# Altium project Relay.PrjPcb
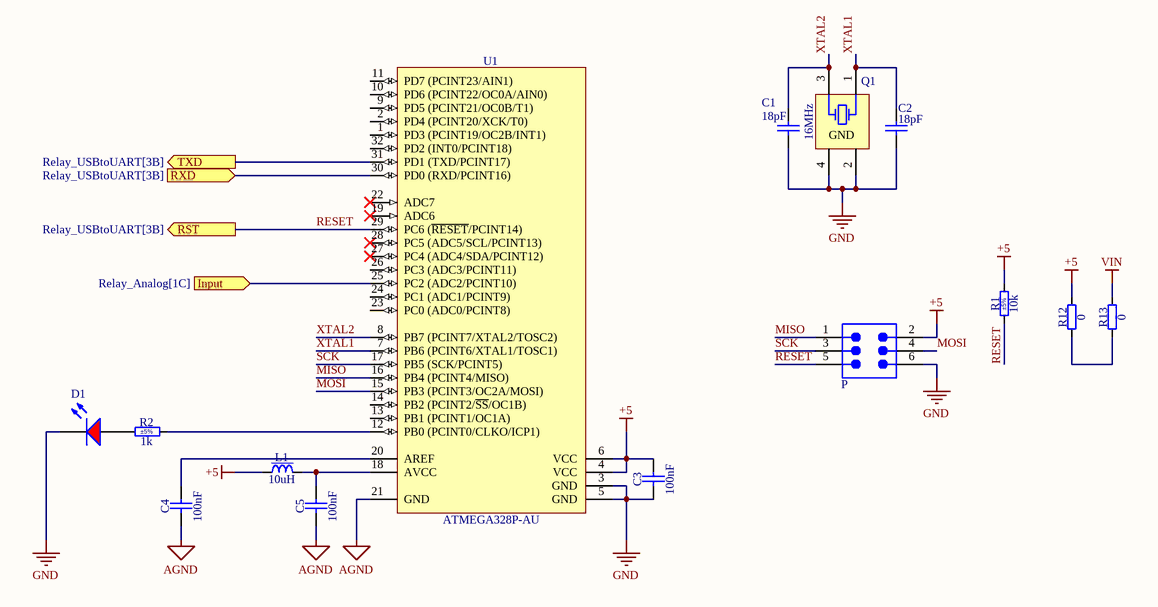
[diagram p0: Relay_MCU.SchDoc]
3 sheets, 61 parts. Net scope: global (net labels, ports and power ports of the same name join across sheets).
Board file: RelayPCB.PcbDoc
Sheets:
  Relay_MCU.SchDoc
  Relay_Analog.SchDoc
  Relay_USBtoUART.SchDoc

## Sheet Relay_MCU.SchDoc
size A4; SheetNumber: 1; SheetTotal: 3; SPICEModelCacheGVUYVZKY: <root> / <DocumentId>GVUYVZKY</DocumentId> / <CacheFrame Number="0"> / <Model Name="0805_150080rs75000" Kind="CKT"> / <Text>****** / .subckt 0805_150080RS75000  1  2 / D1 1 2 SMCW / .MODEL SMCW D / + IS=10.000E-21 / + N=1.6992 / + RS=1.0000E-6 / + IKF=1.2373E-3 / + CJO=1.0000E-12 / + M=.3333 / + VJ=.75 / + BV=5 / + IBV=10.00E-6 / + TT=5.0000E-9 / .ends</Text> / </Model> / </CacheFrame> / </root>

### Parts
C1  18pF  [CAPC2012X135N]
C2  18pF  [CAPC2012X135N]
C3  100nF  [CAPC2012X135N]
C4  100nF  [CAPC2012X135N]
C5  100nF  [CAPC2012X135N]
D1  Red, 2V, 140°  [WL-SMCW_0805_150080xx75000]  (value not drawn)
L1  10uH  [INDC2014X145N]
P  61300621121  [61300621121]  (value not drawn)
Q1  16MHz  [XTAL_EPSON_TSX-3225]
R1  10k  Tolerance: ±5%  [RESC2012X60N]
R2  1k  Tolerance: ±5%  [RESC2012X60N]
R12  0  [RESC2012X60N]
R13  0  [RESC2012X60N]
U1  ATMEGA328P-AU  [QFP80P900X900X120-32N]

### Ports
Input (in, see Relay_Analog[1C]), RST (out, see Relay_USBtoUART[3B]), RXD (in, see Relay_USBtoUART[3B]), TXD (out, see Relay_USBtoUART[3B])

### Nets
+5: C3.2 L1.1 P.2 R1.2 R12.2 U1.4(VCC) U1.6(VCC)
AGND: C4.1 C5.1 U1.21(GND)
GND: C1.1 C2.2 C3.1 D1.1(K) P.6 Q1.2(GND) Q1.4(GND) U1.3(GND) U1.5(GND)
VIN: R13.2
Input: U1.25(PC2_(ADC2/PCINT10)) ; port Input
MISO: P.1 U1.16(PB4_(PCINT4/MISO))
MOSI: P.4 U1.15(PB3_(PCINT3/OC2A/MOSI))
RESET: P.5 R1.1 U1.29(PC6_(~{RESET}/PCINT14)) ; port RST
RXD: U1.30(PD0_(RXD/PCINT16)) ; port RXD
SCK: P.3 U1.17(PB5_(SCK/PCINT5))
TXD: U1.31(PD1_(TXD/PCINT17)) ; port TXD
XTAL1: C2.1 Q1.1(X) U1.7(PB6_(PCINT6/XTAL1/TOSC1))
XTAL2: C1.2 Q1.3(X) U1.8(PB7_(PCINT7/XTAL2/TOSC2))
NetC4_2: C4.2 U1.20(AREF)
NetC5_2: C5.2 L1.2 U1.18(AVCC)
NetD1_2: D1.2(A) R2.1
NetR2_2: R2.2 U1.12(PB0_(PCINT0/CLKO/ICP1))
NetR12_1: R12.1 R13.1

Not connected (* = marked no-connect by the designer): U1 1(PD3_(PCINT19/OC2B/INT1)) 2(PD4_(PCINT20/XCK/T0)) 9(PD5_(PCINT21/OC0B/T1)) 10(PD6_(PCINT22/OC0A/AIN0)) 11(PD7_(PCINT23/AIN1)) 13(PB1_(PCINT1/OC1A)) 14(PB2_(PCINT2/~{SS}/OC1B)) 19(ADC6)* 22(ADC7)* 23(PC0_(ADC0/PCINT8)) 24(PC1_(ADC1/PCINT9)) 26(PC3_(ADC3/PCINT11)) 27(PC4_(ADC4/SDA/PCINT12))* 28(PC5_(ADC5/SCL/PCINT13))* 32(PD2_(INT0/PCINT18))

### Library data of the parts
C1 C2 = CC0805_18PF_50V_5%_NP0: Non-polarised capacitor; Part Description: SMD Multilayer Chip Ceramic Capacitor; Manufacturer: GENERIC; Manufacturer1 Part Number: 223886115189; Voltage: 50V; TC: C0G/NP0; Tolerance: ±5%; Part Number: CC0805_18PF_50V_5%_NP0; Component Kind: Standard; Component Type: Standard; Pin Count: 2; Value: 18pF; Status: Preferred; Manufacturer Part Number: CC0805_18PF_50V_5%_NP0; Case: 0805; Mounted: Yes; Socket: No; SMD: Yes; Sense: No; Manufacturer1 Example: PHYCOMP; Manufacturer1 ComponentHeight: 1.35mm; HelpURL: \\cern.ch\dfs\Applications\Altium\Datasheets\CC0805_NP0_PHYCOMP.pdf; Author: CERN DEM JLC; CreateDate: 3.12.2007; LatestRevisionDate: 3.12.2007
C3-C5 = CC0805_100NF_50V_10%_X7R: Non-polarised capacitor; Part Description: SMD Multilayer Chip Ceramic Capacitor; Manufacturer: GENERIC; Manufacturer1 Part Number: C2012X7R1H104K085; Voltage: 50V; TC: X7R; Tolerance: ±10%; Part Number: CC0805_100NF_50V_10%_X7R; Component Kind: Standard; Component Type: Standard; Pin Count: 2; Value: 100nF; Status: None; Manufacturer Part Number: CC0805_100NF_50V_10%_X7R; Case: 0805; Mounted: Yes; Socket: No; SMD: Yes; Sense: No; Manufacturer1 Example: TDK; Manufacturer1 ComponentHeight: 1mm; HelpURL: \\cern.ch\dfs\Applications\Altium\Datasheets\CC0805_X7R_TDK_C.pdf; Author: CERN DEM JLC; CreateDate: 3.12.2007; LatestRevisionDate: 22.04.2015
D1 = 150080RS75000: WL-SMCW Mono-color Chip LED Waterclear, size 0805, Red, 2V, 140°; Manufacturer: Wurth Elektronik; Case/Size Code: 0805; Chip Technology: AlInGaP; Dominant Wavelength: 625nm; Luminous Intensity: 150mcd; Peak Wavelength: 630nm; Manufacturer Part Number: 150080RS75000; Category: Signal LEDs; Match Code: WL-SMCW; ComponentLink1Description: Website Link; ComponentLink1URL: https://www.we-online.com/redexpert/article/150080RS75000?ad; ComponentLink2Description: Datasheet Link; ComponentLink2URL: https://www.we-online.com/redexpert/spec/150080RS75000?ad; Mount: Surface Mount; Operating Temperature Max: 85°C; Operating Temperature Min: -40°C; Packaging: Tape and Reel; Length: 2mm; Width: 1.25mm; Height: 0.7mm; Emitting Color: Red; Forward Voltage: 2V; Viewing Angle: 140°
L1 = IND0805_10NH_5%_EPCOS_B82498B: Inductor With Core; Part Number: IND0805_10UH_5%_EPCOS_B82498B; Part Description: SMT Inductor SIMID Series; Manufacturer: EPCOS; Manufacturer Part Number: B82498B3100J; Power: 700mA; Resistance: 0.03R; Tolerance: ±5%; Component Kind: Standard; Component Type: Standard; Pin Count: 2; Value: 10uH; Status: Preferred; Case: 0805; Mounted: Yes; Socket: No; SMD: Yes; Sense: No; ComponentHeight: 1.45mm; HelpURL: \\cern.ch\dfs\Applications\Altium\Datasheets\IND0805_EPCOS_B82498B.pdf; Author: CERN DEM JLC; CreateDate: 11.02.2008; LatestRevisionDate: 26.06.2008
P = 61300621121: WR-PHD Pin Header, THT, Vertical, pitch 2.54mm, 2 Row, 6P; Manufacturer: Wurth Elektronik; Contact Resistance: 20mOhm; Rated Current: 3A; Working Voltage: 250V; Withstanding Voltage: 500V; Manufacturer Part Number: 61300621121; Category: Board-to-Board Connectors; Match Code: WR-PHD; ComponentLink1Description: Website Link; ComponentLink1URL: https://www.we-online.com/redexpert/article/61300621121?ad; ComponentLink2Description: Datasheet Link; ComponentLink2URL: https://www.we-online.com/redexpert/spec/61300621121?ad; Mount: Through Hole; Operating Temperature Max: 105°C; Operating Temperature Min: -40°C; Packaging: Bag; Gender: Pin Header; Number of Pins: 6; Number of Rows: 2; Orientation: Vertical; Pitch: 2.54mm
Q1 = XTAL_40MHZ_EPSON_TSX-3225 40.0000MF10Z-B6: Crystal 4 pins 1=XTAL Control 2=GND3=XTAL 4=GND; Part Number: XTAL_16MHZ_EPSON_TSX-3225 40.0000MF10Z-B6; Part Description: Tolerance: ±10ppm,  Stability:±10ppm, -20°C to 75°C, 10pF, Surface Mount Quartz Crystal, TX-3225 Series; Manufacturer: EPSON; PressFit: No; Bonding: No; Component Kind: Standard; Component Type: Standard; PackageDescription: Crystal, Corner Concave; 4 Pin, 2.50mm L X 3.20mm W X 0.6mm H, TSX-3225 Serie; Value: 16MHz; Manufacturer Part Number: TSX-3225 40.0000MF10Z-B6; Pin Count: 4; Mounted: Yes; Socket: No; SMD: Yes; Sense: No; ComponentHeight: 0.6mm; HelpURL: \\cern.ch\dfs\Applications\Altium\Datasheets\XTAL_EPSON_TSX-3225.pdf; ComponentLink1URL: \\cern.ch\dfs\Applications\Altium\Datasheets\XTAL_EPSON_TSX-3225_Ordering-Informations.pdf; ComponentLink1Description: Ordering Informations; Author: CERN DEM HF; CreateDate: 24.10.2023; LatestRevisionDate: 24.10.2023
R1 = R0805_10K_1%_0.125W_100PPM: Resistor - 5%; Part Number: R0805_10K_5%_0.125W_100PPM; Part Description: General Purpose Thick Film Chip Resistor; Manufacturer: GENERIC; Manufacturer1 Part Number: NRC10F1002TRF; Power: 0.125W; TC: ±100ppm/°C; PressFit: No; Component Kind: Standard; Component Type: Standard; Pin Count: 2; Value: 10k; Status: Preferred; Manufacturer Part Number: R0805_10K_5%_0.125W_100PPM; Case: 0805; Mounted: Yes; Sense: No; Socket: No; SMD: Yes; Manufacturer1 Example: NIC COMPONENT; Manufacturer1 ComponentHeight: 0.6mm; HelpURL: \\cern.ch\dfs\Applications\Altium\Datasheets\R0805_NIC_NRC.pdf; Author: CERN DEM JLC; CreateDate: 3.12.2007; LatestRevisionDate: 13.03.2008
R2 = R0805_1K_1%_0.125W_100PPM: Resistor - 5%; Part Number: R0805_1K_5%_0.125W_100PPM; Part Description: General Purpose Thick Film Chip Resistor; Manufacturer: GENERIC; Manufacturer1 Part Number: NRC10F1001TRF; Power: 0.125W; TC: ±100ppm/°C; PressFit: No; Component Kind: Standard; Component Type: Standard; Pin Count: 2; Value: 1k; Status: Preferred; Manufacturer Part Number: R0805_1K_5%_0.125W_100PPM; Case: 0805; Mounted: Yes; Sense: No; Socket: No; SMD: Yes; Manufacturer1 Example: NIC COMPONENT; Manufacturer1 ComponentHeight: 0.6mm; HelpURL: \\cern.ch\dfs\Applications\Altium\Datasheets\R0805_NIC_NRC.pdf; Author: CERN DEM JLC; CreateDate: 3.12.2007; LatestRevisionDate: 13.03.2008
R12 R13 = R0805_0R_JUMPER: Resistor; Part Description: 2A (0.05R Max DC Resistance) Zero Ohm Jumper; Manufacturer: GENERIC; Manufacturer1 Part Number: NRC10Z0; PressFit: No; Part Number: R0805_0R_JUMPER; Component Kind: Standard; Component Type: Standard; Pin Count: 2; Value: 0; Status: Preferred; Manufacturer Part Number: R0805_0R_JUMPER; Case: 0805; Mounted: Yes; Sense: No; Socket: No; SMD: Yes; Manufacturer1 Example: NIC COMPONENT; Manufacturer1 ComponentHeight: 0.6mm; HelpURL: \\cern.ch\dfs\Applications\Altium\Datasheets\R0805_NIC_NRC.pdf; Author: CERN DEM JLC; CreateDate: 3.12.2007; LatestRevisionDate: 13.03.2008
U1 = ATMEGA328P-AU: 8-bit AVR Microcontroller, 32KB Flash, 1KB EEPROM, 2KB SRAM, 32-Pin TQFP; Part Description: 8-bit AVR Microcontroller, 32KB Flash, 1KB EEPROM, 2KB SRAM, 32-Pin TQFP, Industrial Grade (-40°C to 85°C); Manufacturer: ATMEL; PressFit: No; Bonding: No; Part Number: ATMEGA328P-AU; Component Kind: Standard; Component Type: Standard; Device: ATMEGA328P-AU; PackageDescription: QFP, 0.80mm Pitch, Square; 32 Pin, 7.00mm L X 7.00mm W X 1.20mm H body, IPC Medium Density; Manufacturer Part Number: ATMEGA328P-AU; Pin Count: 32; Case: QFP32; Mounted: Yes; Socket: No; SMD: Yes; Sense: No; ComponentHeight: 1.2mm; HelpURL: \\cern.ch\dfs\Applications\Altium\Datasheets\ATMEGA328P-AU.pdf; Author: CERN DEM JLC; CreateDate: 2.07.2014; LatestRevisionDate: 2.07.2014

## Sheet Relay_Analog.SchDoc
size A4; SheetNumber: 2; SheetTotal: 3; SPICEModelCacheDQOFJLTE: <root> / <DocumentId>DQOFJLTE</DocumentId> / </root>
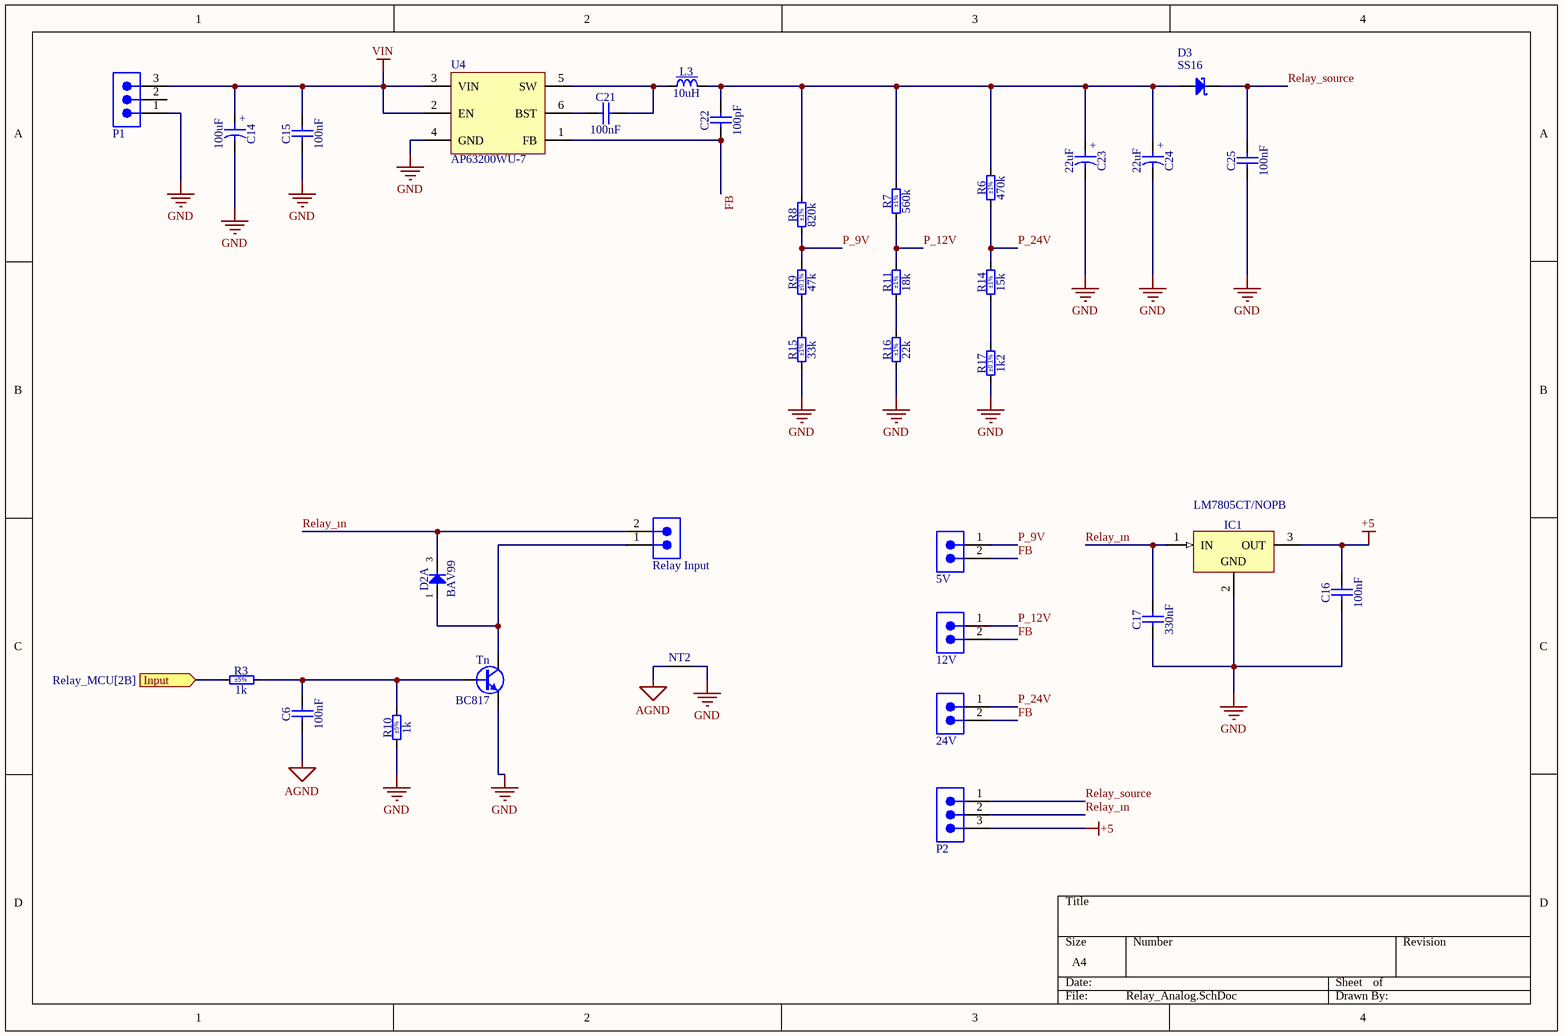
[diagram p1: Relay_Analog.SchDoc]

### Parts
5V  61300211121  [61300211121]  (value not drawn)
12V  61300211121  [61300211121]  (value not drawn)
24V  61300211121  [61300211121]  (value not drawn)
C6  100nF  [CAPC2012X135N]
C14  100uF  [CAPPR250-680X1250]
C15  100nF  [CAPC2012X135N]
C16  100nF  [CAPC2012X135N]
C17  330nF  [CAPC2012X135N]
C21  100nF  [CAPC2012X135N]
C22  100pF  [CAPC2012X135N]
C23  22uF  [CAPPR250-500X1100]
C24  22uF  [CAPPR250-500X1100]
C25  100nF  [CAPC2012X135N]
D2  BAV99  [SOT95P240X110-3N]  (part A of 2)
D3  SS16  [DIOM5127X229N]
IC1  LM7805CT/NOPB  [TO-220-V]
L3  10uH  [IND_TRACO_TCK-047]
NT2  (no value)  [NET-TIE]  (net tie, no BOM)
P1  691322310003  [691322310003]  (value not drawn)
P2  61300311121  [61300311121]  (value not drawn)
R3  1k  Tolerance: ±5%  [RESC2012X60N]
R6  470k  Tolerance: ±1%  [RESC2012X60N]
R7  560k  Tolerance: ±1%  [RESC2012X60N]
R8  820k  Tolerance: ±1%  [RESC2012X60N]
R9  47k  Tolerance: ±0.1%  [RESC2012X60N]
R10  1k  Tolerance: ±5%  [RESC2012X60N]
R11  18k  Tolerance: ±1%  [RESC2012X60N]
R14  15k  Tolerance: ±1%  [RESC2012X60N]
R15  33k  Tolerance: ±1%  [RESC2012X60N]
R16  22k  Tolerance: ±1%  [RESC2012X60N]
R17  1k2  Tolerance: ±0.1%  [RESC2013X65N]
Relay_Input  691322310002  [691322310002]  (value not drawn)
Tn  BC817  [SOT95P230X110-3N]
U4  AP63200WU-7  [TSOT26]

### Ports
Input (in, see Relay_MCU[2B])

### Nets
+5: C16.2 IC1.3(OUT) P2.3
AGND: C6.1 NT2.1
GND: C14.2 C15.1 C16.1 C17.1 C23.2 C24.2 C25.1 IC1.2(GND) NT2.2 P1.1 R10.1 R15.1 R16.1 R17.1 Tn.2(E) U4.4(GND)
VIN: C14.1 C15.2 P1.3 U4.2(EN) U4.3(VIN)
FB: 5V.2 12V.2 24V.2 C22.1 U4.1(FB)
Input: R3.1 ; port Input
P_9V: 5V.1 R8.1 R9.2
P_12V: 12V.1 R7.1 R11.2
P_24V: 24V.1 R6.1 R14.2
Relay_source: C25.2 D3.1(C) P2.1
Relay_ın: C17.2 D2.3(COMAC) IC1.1(IN) P2.2 Relay_Input.2
NetC6_2: C6.2 R3.2 R10.2 Tn.1(B)
NetC21_1: C21.1 U4.6(BST)
NetC21_2: C21.2 L3.1 U4.5(SW)
NetC22_2: C22.2 C23.1 C24.1 D3.2(A) L3.2 R6.2 R7.2 R8.2
NetD2_1: D2.1(A) Relay_Input.1 Tn.3(C)
NetR9_1: R9.1 R15.2
NetR11_1: R11.1 R16.2
NetR14_1: R14.1 R17.2

Not connected (* = marked no-connect by the designer): P1 2

### Notes on the sheet
- (in symbol CAER_47UF_25V_20%_250-500X1100) +
- (in symbol CAER_100UF_25V_20%_NICHICON_UPS1E101MED) +

### Library data of the parts
5V 12V 24V = 61300211121: WR-PHD Pin Header, THT, Vertical, pitch 2.54mm, 1 Row, 2P; Manufacturer: Wurth Elektronik; Contact Resistance: 20mOhm; Rated Current: 3A; Working Voltage: 250V; Withstanding Voltage: 500V; Manufacturer Part Number: 61300211121; Category: Board-to-Board Connectors; Match Code: WR-PHD; ComponentLink1Description: Website Link; ComponentLink1URL: https://www.we-online.com/redexpert/article/61300211121?ad; ComponentLink2Description: Datasheet Link; ComponentLink2URL: https://www.we-online.com/redexpert/spec/61300211121?ad; Mount: Through Hole; Operating Temperature Max: 105°C; Operating Temperature Min: -40°C; Packaging: Bag; Gender: Pin Header; Number of Pins: 2; Number of Rows: 1; Orientation: Vertical; Pitch: 2.54mm
C6 C15 C16 C21 C25 = CC0805_100NF_50V_10%_X7R: as C3 on sheet Relay_MCU; Part Number: CC0805_100NF_50V_10%_X7R; Component Kind: Standard; Component Type: Standard; Pin Count: 2; Value: 100nF; Status: None; Manufacturer Part Number: CC0805_100NF_50V_10%_X7R; Case: 0805; Mounted: Yes; Socket: No; SMD: Yes; Sense: No; Manufacturer1 Example: TDK; Manufacturer1 ComponentHeight: 1mm; HelpURL: \\cern.ch\dfs\Applications\Altium\Datasheets\CC0805_X7R_TDK_C.pdf; Author: CERN DEM JLC; CreateDate: 3.12.2007; LatestRevisionDate: 22.04.2015
C14 = CAER_100UF_25V_20%_NICHICON_UPS1E101MED: Polarised capacitor; Part Description: Aluminium Electrolytic Capacitor (UPS Series); Voltage: 25V; Tolerance: ±20%; Part Number: CAER_100UF_25V_20%_NICHICON_UPS1E101MED; Component Kind: Standard; Component Type: Standard; Pin Count: 2; Value: 100uF; Status: None; Manufacturer: NICHICON; Manufacturer Part Number: UPS1E101MED; Case: LS2.5 D6.3 x H11; Mounted: Yes; Socket: No; SMD: No; Sense: No; ComponentHeight: 12.5mm; HelpURL: \\cern.ch\dfs\Applications\Altium\Datasheets\CAER_NICHICON_UPS.pdf; Author: CERN DEM MR; CreateDate: 30.05.2016; LatestRevisionDate: 30.05.2016
C17 = CC0805_330NF_16V_10%_X7R: Non-polarised capacitor; Part Description: SMD Multilayer Chip Ceramic Capacitor; Manufacturer: GENERIC; Manufacturer1 Part Number: CC0805KKX7R7BB334; Voltage: 16V; TC: X7R; Tolerance: ±10%; Part Number: CC0805_330NF_16V_10%_X7R; Component Kind: Standard; Component Type: Standard; Pin Count: 2; Value: 330nF; Status: Preferred; Manufacturer Part Number: CC0805_330NF_16V_10%_X7R; Case: 0805; Mounted: Yes; Socket: No; SMD: Yes; Sense: No; Manufacturer1 Example: YAGEO PHYCOMP; Manufacturer1 ComponentHeight: 1.45mm; HelpURL: \\cern.ch\dfs\Applications\Altium\Datasheets\CC0805_X7R_YAGEO_HIGH CAPACITANCE_MAX50V.pdf; Author: CERN DEM JLC; CreateDate: 3.12.2007; LatestRevisionDate: 21.04.2015
C22 = CC0805_100PF_50V_5%_NP0: Non-polarised capacitor; Part Description: SMD Multilayer Chip Ceramic Capacitor; Manufacturer: GENERIC; Manufacturer1 Part Number: 223886115101; Voltage: 50V; TC: C0G/NP0; Tolerance: ±5%; Part Number: CC0805_100PF_50V_5%_NP0; Component Kind: Standard; Component Type: Standard; Pin Count: 2; Value: 100pF; Status: Preferred; Manufacturer Part Number: CC0805_100PF_50V_5%_NP0; Case: 0805; Mounted: Yes; Socket: No; SMD: Yes; Sense: No; Manufacturer1 Example: PHYCOMP; Manufacturer1 ComponentHeight: 1.35mm; HelpURL: \\cern.ch\dfs\Applications\Altium\Datasheets\CC0805_NP0_PHYCOMP.pdf; Author: CERN DEM JLC; CreateDate: 3.12.2007; LatestRevisionDate: 3.12.2007
C23 C24 = CAER_47UF_25V_20%_250-500X1100: Polarised capacitor; Part Number: CAER_22UF_25V_20%_250-500X1100; Part Description: Aluminum Electrolytic Capacitor; Manufacturer: GENERIC; Manufacturer1 Part Number: EEUFC1E470; Voltage: 25V; Tolerance: ±20%; Component Kind: Standard; Component Type: Standard; Pin Count: 2; Value: 22uF; Status: Preferred; Manufacturer Part Number: CAER_47UF_25V_20%_250-500X1100; Case: LS2.5 D5 x H11; Mounted: Yes; Socket: No; SMD: No; Sense: No; ComponentHeight: 11mm; Manufacturer1 Example: PANASONIC; Manufacturer1 ComponentHeight: 11mm; HelpURL: \\cern.ch\dfs\Applications\Altium\Datasheets\CAER_PANASONIC_FC.pdf; Author: CERN DEM JLC; CreateDate: 18.12.2007; LatestRevisionDate: 18.12.2007
D2 = BAV99: Serial Diode; Part Description: Dual Series Signal Diode; Manufacturer: FAIRCHILD SEMICONDUCTOR; Voltage: 70V; Power: 350mW; PressFit: No; Bonding: No; Part Number: BAV99; Component Kind: Standard; Component Type: Standard; Device: BAV99; PackageDescription: SOT, 0.95mm Pitch; 3 Pin, 1.40mm W X 3.00mm L X 1.10mm H body, IPC Medium Density; Manufacturer Part Number: BAV99; Pin Count: 3; Case: SOT23-3; Mounted: Yes; Socket: No; SMD: Yes; Sense: No; ComponentHeight: 1.1mm; HelpURL: \\cern.ch\dfs\Applications\Altium\Datasheets\BAV99.pdf; Author: CERN DEM JLC; CreateDate: 6.05.2008; LatestRevisionDate: 27.09.2012
D3 = SS16: Schottky Diode; Part Description: Surface Mount Schottky Barrier Rectifier; Manufacturer: VISHAY GENERAL SEMICONDUCTOR; Voltage: 60V; Power: 1A; PressFit: No; Bonding: No; Part Number: SS16; Component Kind: Standard; Component Type: Standard; Device: SS16; PackageDescription: DO-214-AC/SMA Diode, Molded Body; 5.10mm L X 2.67mm W X 2.29mm H, IPC Medium Density; Manufacturer Part Number: SS16; Pin Count: 2; Case: DO-214AC; Mounted: Yes; Socket: No; SMD: Yes; Sense: No; ComponentHeight: 2.29mm; HelpURL: \\cern.ch\dfs\Applications\Altium\Datasheets\SS16.pdf; Author: CERN DEM JLC; CreateDate: 15.07.2008; LatestRevisionDate: 23.08.2010
IC1 = LM7805CT/NOPB_v: 3-Terminal Regulator 1=IN 2=GND 3=OUT; Part Description: 3-Terminal 5V 1A Positive Voltage Regulator; Manufacturer: TEXAS INSTRUMENTS; PressFit: No; Bonding: No; Part Number: LM7805CT/NOPB_v; Component Kind: Standard; Component Type: Standard; Device: LM7805CT/NOPB; PackageDescription: TO-220 3-Terminal + Tab - Vertical Mount; Manufacturer Part Number: LM7805CT; Pin Count: 3; Case: TO-220; Mounted: Yes; Socket: No; SMD: No; Sense: No; ComponentHeight: 18.95mm; HelpURL: \\cern.ch\dfs\Applications\Altium\Datasheets\LM7805CT-NOPB.pdf; Author: CERN DEM JLC; CreateDate: 18.12.2018; LatestRevisionDate: 1.06.2022
L3 = IND_10UH_20%_TRACO_TCK-047: Inductor With Core; Part Description: SMD Common Mode Choke; Manufacturer: TRACO POWER; Power: 1.44A; Resistance: 0.1R; Tolerance: ±20%; Part Number: IND_10UH_20%_TRACO_TCK-047; Component Kind: Standard; Component Type: Standard; Pin Count: 2; Value: 10uH; Manufacturer Part Number: TCK-047; Mounted: Yes; Socket: No; SMD: Yes; Sense: No; ComponentHeight: 4.85mm; HelpURL: \\cern.ch\dfs\Applications\Altium\Datasheets\IND_TRACO_TCK-047.pdf; Author: CERN DEM JLC; CreateDate: 16.11.2017; LatestRevisionDate: 16.11.2017
NT2 = Net Tie
P1 = 691322310003: WR-TBL Series 322 Horizontal PCB Header, THT, pitch 3.81mm, 3p; Manufacturer: Wurth Elektronik; Modularity: No; Rated Current: 10A; Working Voltage: 300V; Manufacturer Part Number: 691322310003; Category: Terminal Blocks; Match Code: WR-TBL; ComponentLink1Description: Website Link; ComponentLink1URL: https://www.we-online.com/redexpert/article/691322310003?ad; ComponentLink2Description: Datasheet Link; ComponentLink2URL: https://www.we-online.com/redexpert/spec/691322310003?ad; Mount: Through Hole; Operating Temperature Max: 105°C; Operating Temperature Min: -40°C; Packaging: Box; Application: Pluggable; Number of Pins: 3; Number of Rows: 1; Orientation: Horizontal; Pitch: 3.81mm
P2 = 61300311121: WR-PHD Pin Header, THT, Vertical, pitch 2.54mm, 1 Row, 3P; Manufacturer: Wurth Elektronik; Contact Resistance: 20mOhm; Rated Current: 3A; Working Voltage: 250V; Withstanding Voltage: 500V; Manufacturer Part Number: 61300311121; Category: Board-to-Board Connectors; Match Code: WR-PHD; ComponentLink1Description: Website Link; ComponentLink1URL: https://www.we-online.com/redexpert/article/61300311121?ad; ComponentLink2Description: Datasheet Link; ComponentLink2URL: https://www.we-online.com/redexpert/spec/61300311121?ad; Mount: Through Hole; Operating Temperature Max: 105°C; Operating Temperature Min: -40°C; Packaging: Bag; Gender: Pin Header; Number of Pins: 3; Number of Rows: 1; Orientation: Vertical; Pitch: 2.54mm
R3 R10 = R0805_1K_1%_0.125W_100PPM: as R2 on sheet Relay_MCU; Component Kind: Standard; Component Type: Standard; Pin Count: 2; Value: 1k; Status: Preferred; Manufacturer Part Number: R0805_1K_5%_0.125W_100PPM; Case: 0805; Mounted: Yes; Sense: No; Socket: No; SMD: Yes; Manufacturer1 Example: NIC COMPONENT; Manufacturer1 ComponentHeight: 0.6mm; HelpURL: \\cern.ch\dfs\Applications\Altium\Datasheets\R0805_NIC_NRC.pdf; Author: CERN DEM JLC; CreateDate: 3.12.2007; LatestRevisionDate: 13.03.2008
R6 = R0805_470K_1%_0.125W_100PPM: Resistor - 1%; Part Description: General Purpose Thick Film Chip Resistor; Manufacturer: GENERIC; Manufacturer1 Part Number: NRC10F4703TRF; Power: 0.125W; TC: ±100ppm/°C; PressFit: No; Part Number: R0805_470K_1%_0.125W_100PPM; Component Kind: Standard; Component Type: Standard; Pin Count: 2; Value: 470k; Status: Preferred; Manufacturer Part Number: R0805_470K_1%_0.125W_100PPM; Case: 0805; Mounted: Yes; Sense: No; Socket: No; SMD: Yes; Manufacturer1 Example: NIC COMPONENT; Manufacturer1 ComponentHeight: 0.6mm; HelpURL: \\cern.ch\dfs\Applications\Altium\Datasheets\R0805_NIC_NRC.pdf; Author: CERN DEM JLC; CreateDate: 3.12.2007; LatestRevisionDate: 13.03.2008
R7 = R0805_560K_1%_0.125W_100PPM: Resistor - 1%; Part Description: General Purpose Thick Film Chip Resistor; Manufacturer: GENERIC; Manufacturer1 Part Number: NRC10F5603TRF; Power: 0.125W; TC: ±100ppm/°C; PressFit: No; Part Number: R0805_560K_1%_0.125W_100PPM; Component Kind: Standard; Component Type: Standard; Pin Count: 2; Value: 560k; Status: Preferred; Manufacturer Part Number: R0805_560K_1%_0.125W_100PPM; Case: 0805; Mounted: Yes; Sense: No; Socket: No; SMD: Yes; Manufacturer1 Example: NIC COMPONENT; Manufacturer1 ComponentHeight: 0.6mm; HelpURL: \\cern.ch\dfs\Applications\Altium\Datasheets\R0805_NIC_NRC.pdf; Author: CERN DEM JLC; CreateDate: 3.12.2007; LatestRevisionDate: 13.03.2008
R8 = R0805_820K_1%_0.125W_100PPM: Resistor - 1%; Part Description: General Purpose Thick Film Chip Resistor; Manufacturer: GENERIC; Manufacturer1 Part Number: NRC10F8203TRF; Power: 0.125W; TC: ±100ppm/°C; PressFit: No; Part Number: R0805_820K_1%_0.125W_100PPM; Component Kind: Standard; Component Type: Standard; Pin Count: 2; Value: 820k; Status: Preferred; Manufacturer Part Number: R0805_820K_1%_0.125W_100PPM; Case: 0805; Mounted: Yes; Sense: No; Socket: No; SMD: Yes; Manufacturer1 Example: NIC COMPONENT; Manufacturer1 ComponentHeight: 0.6mm; HelpURL: \\cern.ch\dfs\Applications\Altium\Datasheets\R0805_NIC_NRC.pdf; Author: CERN DEM JLC; CreateDate: 3.12.2007; LatestRevisionDate: 13.03.2008
R9 = R0805_47K_0.1%_0.125W_25PPM: Resistor - 0.1%; Part Description: Thin Film Chip Resistor; Manufacturer: GENERIC; Manufacturer1 Part Number: ERA6AEB473V; Power: 0.125W; TC: ±25ppm; PressFit: No; Part Number: R0805_47K_0.1%_0.125W_25PPM; Component Kind: Standard; Component Type: Standard; Pin Count: 2; Value: 47k; Status: Not Recommended; Manufacturer Part Number: R0805_47K_0.1%_0.125W_25PPM; Case: 0805; Mounted: Yes; Sense: No; Socket: No; SMD: Yes; Manufacturer1 Example: PANASONIC; Manufacturer1 ComponentHeight: 0.6mm; HelpURL: \\cern.ch\dfs\Applications\Altium\Datasheets\R0805_PANASONIC_ERA.pdf; Author: CERN DEM JLC; CreateDate: 18.10.2010; LatestRevisionDate: 18.10.2010
R11 = R0805_18K_1%_0.125W_100PPM: Resistor - 1%; Part Description: General Purpose Thick Film Chip Resistor; Manufacturer: GENERIC; Manufacturer1 Part Number: NRC10F1802TRF; Power: 0.125W; TC: ±100ppm/°C; PressFit: No; Part Number: R0805_18K_1%_0.125W_100PPM; Component Kind: Standard; Component Type: Standard; Pin Count: 2; Value: 18k; Status: Preferred; Manufacturer Part Number: R0805_18K_1%_0.125W_100PPM; Case: 0805; Mounted: Yes; Sense: No; Socket: No; SMD: Yes; Manufacturer1 Example: NIC COMPONENT; Manufacturer1 ComponentHeight: 0.6mm; HelpURL: \\cern.ch\dfs\Applications\Altium\Datasheets\R0805_NIC_NRC.pdf; Author: CERN DEM JLC; CreateDate: 3.12.2007; LatestRevisionDate: 13.03.2008
R14 = R0805_15K_1%_0.125W_100PPM: Resistor - 1%; Part Description: General Purpose Thick Film Chip Resistor; Manufacturer: GENERIC; Manufacturer1 Part Number: NRC10F1502TRF; Power: 0.125W; TC: ±100ppm/°C; PressFit: No; Part Number: R0805_15K_1%_0.125W_100PPM; Component Kind: Standard; Component Type: Standard; Pin Count: 2; Value: 15k; Status: Preferred; Manufacturer Part Number: R0805_15K_1%_0.125W_100PPM; Case: 0805; Mounted: Yes; Sense: No; Socket: No; SMD: Yes; Manufacturer1 Example: NIC COMPONENT; Manufacturer1 ComponentHeight: 0.6mm; HelpURL: \\cern.ch\dfs\Applications\Altium\Datasheets\R0805_NIC_NRC.pdf; Author: CERN DEM JLC; CreateDate: 13.05.2013; LatestRevisionDate: 13.05.2013
R15 = R0805_33K_1%_0.125W_100PPM: Resistor - 1%; Part Description: General Purpose Thick Film Chip Resistor; Manufacturer: GENERIC; Manufacturer1 Part Number: NRC10F3302TRF; Power: 0.125W; TC: ±100ppm/°C; PressFit: No; Part Number: R0805_33K_1%_0.125W_100PPM; Component Kind: Standard; Component Type: Standard; Pin Count: 2; Value: 33k; Status: Preferred; Manufacturer Part Number: R0805_33K_1%_0.125W_100PPM; Case: 0805; Mounted: Yes; Sense: No; Socket: No; SMD: Yes; Manufacturer1 Example: NIC COMPONENT; Manufacturer1 ComponentHeight: 0.6mm; HelpURL: \\cern.ch\dfs\Applications\Altium\Datasheets\R0805_NIC_NRC.pdf; Author: CERN DEM JLC; CreateDate: 3.12.2007; LatestRevisionDate: 13.03.2008
R16 = R0805_22K_1%_0.125W_100PPM: Resistor - 1%; Part Description: General Purpose Thick Film Chip Resistor; Manufacturer: GENERIC; Manufacturer1 Part Number: NRC10F2202TRF; Power: 0.125W; TC: ±100ppm/°C; PressFit: No; Part Number: R0805_22K_1%_0.125W_100PPM; Component Kind: Standard; Component Type: Standard; Pin Count: 2; Value: 22k; Status: Preferred; Manufacturer Part Number: R0805_22K_1%_0.125W_100PPM; Case: 0805; Mounted: Yes; Sense: No; Socket: No; SMD: Yes; Manufacturer1 Example: NIC COMPONENT; Manufacturer1 ComponentHeight: 0.6mm; HelpURL: \\cern.ch\dfs\Applications\Altium\Datasheets\R0805_NIC_NRC.pdf; Author: CERN DEM JLC; CreateDate: 3.12.2007; LatestRevisionDate: 13.03.2008
R17 = R0805_1K2_0.1%_0.1W_25PPM: Resistor - 0.1%; Part Description: Thin Film Precision Resistor; Manufacturer: GENERIC; Manufacturer1 Part Number: CPF0805B1K2E; Power: 0.1W; TC: ±25ppm/°C; PressFit: No; Part Number: R0805_1K2_0.1%_0.1W_25PPM; Component Kind: Standard; Component Type: Standard; Pin Count: 2; Value: 1k2; Status: Not Recommended; Manufacturer Part Number: R0805_1K2_0.1%_0.1W_25PPM; Case: 0805; Mounted: Yes; Sense: No; Socket: No; SMD: Yes; Manufacturer1 Example: TYCO ELECTRONICS; Manufacturer1 ComponentHeight: 0.65mm; HelpURL: \\cern.ch\dfs\Applications\Altium\Datasheets\R0805_TYCO_CPF.pdf; Author: CERN DEM JMW; CreateDate: 21.05.2010; LatestRevisionDate: 21.05.2010
Relay_Input = 691322310002: WR-TBL Series 322 Horizontal PCB Header, THT, pitch 3.81mm, 2p; Manufacturer: Wurth Elektronik; Modularity: No; Rated Current: 10A; Working Voltage: 300V; Manufacturer Part Number: 691322310002; Category: Terminal Blocks; Match Code: WR-TBL; ComponentLink1Description: Website Link; ComponentLink1URL: https://www.we-online.com/redexpert/article/691322310002?ad; ComponentLink2Description: Datasheet Link; ComponentLink2URL: https://www.we-online.com/redexpert/spec/691322310002?ad; Mount: Through Hole; Operating Temperature Max: 105°C; Operating Temperature Min: -40°C; Packaging: Box; Application: Pluggable; Number of Pins: 2; Number of Rows: 1; Orientation: Horizontal; Pitch: 3.81mm
Tn = BC817: NPN Transistor; Part Description: 45V 500mA NPN General-Purpose Transistor; Manufacturer: NXP SEMICONDUCTORS; PressFit: No; Bonding: No; Part Number: BC817; Component Kind: Standard; Component Type: Standard; Device: BC817; PackageDescription: SOT23, 0.95mm Pitch; 3 Pin, 1.30mm W X 2.90mm L X 1.10mm H body, IPC Medium Density; Manufacturer Part Number: BC817; Pin Count: 3; Case: SOT23-3; Mounted: Yes; Socket: No; SMD: Yes; Sense: No; ComponentHeight: 1.1mm; HelpURL: \\cern.ch\dfs\Applications\Altium\Datasheets\BC817.pdf; Author: CERN DEM JLC; CreateDate: 12.05.2011; LatestRevisionDate: 12.05.2011
U4 = AP63200WU-7: Switching Regulator; Manufacturer: Diodes; Supplier: Future Electronics; Supplier Part Number: 2108618; Manufacturer Part Number: AP63200WU-7; RoHS: Yes; Category: Voltage Regulators - Switching; Stock: 9000; Pricing: 3000=0,285, 6000=0,28, 9000=0,275, 12000=0,275, 15000=0,27 (USD); ComponentLink1URL: https://datasheet.ciiva.com:443/pdfs/VipMasterIC/IC/DIOD/DIOD-S-A0007089856/DIOD-S-A0007089856-1.pdf?src-supplier=IHS+Markit; ComponentLink1Description: https://datasheet.ciiva.com:443/pdfs/VipMasterIC/IC/DIOD/DIOD-S-A0007089856/DIOD-S-A0007089856-1.pdf?src-supplier=IHS+Markit; ComponentLink2URL: https://www.diodes.com/assets/Datasheets/AP63200-AP63201-AP63203-AP63205.pdf?src-supplier=Digikey; ComponentLink2Description: https://www.diodes.com/assets/Datasheets/AP63200-AP63201-AP63203-AP63205.pdf?src-supplier=Digikey

## Sheet Relay_USBtoUART.SchDoc
size A4; SheetNumber: 3; SheetTotal: 3
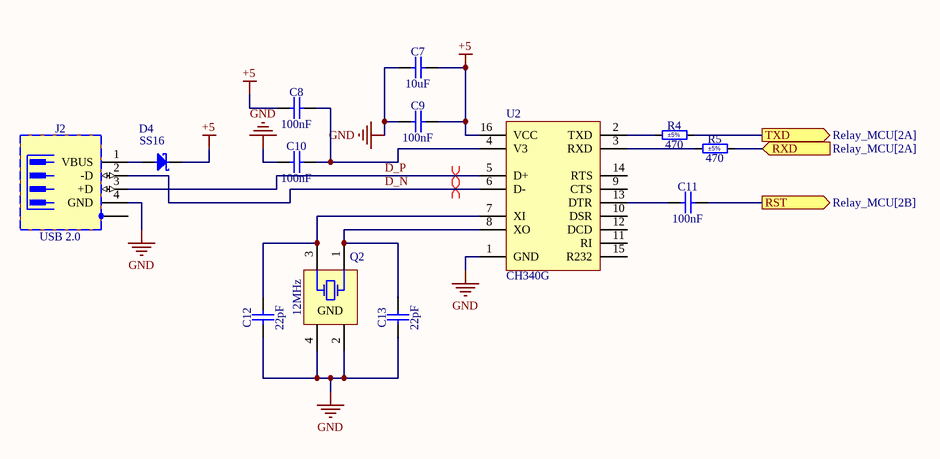
[diagram p2: Relay_USBtoUART.SchDoc]

### Parts
C7  10uF  [CAPC2012X135N]
C8  100nF  [CAPC2012X135N]
C9  100nF  [CAPC2012X135N]
C10  100nF  [CAPC2012X135N]
C11  100nF  [CAPC2012X135N]
C12  22pF  [CAPC2012X88N]
C13  22pF  [CAPC2012X88N]
D4  SS16  [DIOM5127X229N]
J2  USB 2.0  [ASSMANN_A-USBSB]
Q2  12MHz  [XTAL_EPSON_TSX-3225]
R4  470  Tolerance: ±5%  [RESC2012X60N]
R5  470  Tolerance: ±5%  [RESC2012X60N]
U2  CH340G  [SOIC-16]

### Ports
RST (out, see Relay_MCU[2B]), RXD (in, see Relay_MCU[2A]), TXD (out, see Relay_MCU[2A])

### Nets
+5: C7.2 C8.1 C9.2 D4.1(C) U2.16(VCC)
GND: C7.1 C9.1 C10.1 C12.1 C13.1 J2.4(GND) Q2.2(GND) Q2.4(GND) U2.1(GND)
D_N: J2.2(-D) U2.6(D-)
D_P: J2.3(+D) U2.5(D+)
RESET: C11.2 ; port RST
RXD: R5.2 ; port RXD
TXD: R4.2 ; port TXD
NetC8_2: C8.2 C10.2 U2.4(V3)
NetC11_1: C11.1 U2.13(DTR)
NetC12_2: C12.2 Q2.3(X) U2.7(XI)
NetC13_2: C13.2 Q2.1(X) U2.8(XO)
NetD4_2: D4.2(A) J2.1(VBUS)
NetR4_1: R4.1 U2.2(TXD)
NetR5_1: R5.1 U2.3(RXD)

Not connected (* = marked no-connect by the designer): J2 5(SHIELD); U2 9(CTS) 10(DSR) 11(RI) 12(DCD) 14(RTS) 15(R232)

### Layout directives
differential pair: D_N, D_P

### Library data of the parts
C7 = CC0805_10UF_10V_10%_X7R: Non-polarised capacitor; Part Description: SMD Multilayer Chip Ceramic Capacitor; Manufacturer: GENERIC; Manufacturer1 Part Number: GRM21BR71A106KE51L; Voltage: 10V; TC: X7R; Tolerance: ±10%; Part Number: CC0805_10UF_10V_10%_X7R; Component Kind: Standard; Component Type: Standard; Pin Count: 2; Value: 10uF; Status: Preferred; Manufacturer Part Number: CC0805_10UF_10V_10%_X7R; Case: 0805; Mounted: Yes; Socket: No; SMD: Yes; Sense: No; Manufacturer1 Example: MURATA; Manufacturer1 ComponentHeight: 1.35mm; HelpURL: \\cern.ch\dfs\Applications\Altium\Datasheets\CC0805_X7R_MURATA.pdf; Author: CERN DEM JLC; CreateDate: 30.04.2012; LatestRevisionDate: 30.04.2012
C8-C11 = CC0805_100NF_50V_10%_X7R: as C3 on sheet Relay_MCU; Part Number: CC0805_100NF_50V_10%_X7R; Component Kind: Standard; Component Type: Standard; Pin Count: 2; Value: 100nF; Status: None; Manufacturer Part Number: CC0805_100NF_50V_10%_X7R; Case: 0805; Mounted: Yes; Socket: No; SMD: Yes; Sense: No; Manufacturer1 Example: TDK; Manufacturer1 ComponentHeight: 1mm; HelpURL: \\cern.ch\dfs\Applications\Altium\Datasheets\CC0805_X7R_TDK_C.pdf; Author: CERN DEM JLC; CreateDate: 3.12.2007; LatestRevisionDate: 22.04.2015
C12 C13 = CC0805_22PF_200V_5%_C0G: Non-polarised capacitor; Part Description: SMD Multilayer Chip Ceramic Capacitor; Manufacturer: GENERIC; Manufacturer1 Part Number: C0805C220J2GAC; Voltage: 200V; TC: C0G/NP0; Tolerance: ±5%; Part Number: CC0805_22PF_200V_5%_C0G; Component Kind: Standard; Component Type: Standard; Pin Count: 2; Value: 22pF; Status: None; Manufacturer Part Number: CC0805_22PF_200V_5%_C0G; Case: 0805; Mounted: Yes; Socket: No; SMD: Yes; Sense: No; Manufacturer1 Example: KEMET; Manufacturer1 ComponentHeight: 0.88mm; HelpURL: \\cern.ch\dfs\Applications\Altium\Datasheets\CC0805_C0G_KEMET_(Commercial Grade).pdf; Author: CERN DEM MR; CreateDate: 2.06.2016; LatestRevisionDate: 2.06.2016
D4 = SS16: as D3 on sheet Relay_Analog; Part Number: SS16; Component Kind: Standard; Component Type: Standard; Device: SS16; PackageDescription: DO-214-AC/SMA Diode, Molded Body; 5.10mm L X 2.67mm W X 2.29mm H, IPC Medium Density; Manufacturer Part Number: SS16; Pin Count: 2; Case: DO-214AC; Mounted: Yes; Socket: No; SMD: Yes; Sense: No; ComponentHeight: 2.29mm; HelpURL: \\cern.ch\dfs\Applications\Altium\Datasheets\SS16.pdf; Author: CERN DEM JLC; CreateDate: 15.07.2008; LatestRevisionDate: 23.08.2010
J2 = ASSMANN_A-USBSB: 4 Pin + 1 Shield USB Receptacle; Part Description: USB 2.0 Style B Right Angle 4 Contacts Receptacle; PressFit: No; Part Number: ASSMANN_A-USBSB; Component Kind: Standard; Component Type: Standard; Pin Count: 5; Family: USB 2.0; Mounted: Yes; Socket: No; SMD: No; Sense: No; Status: None; Manufacturer: ASSMANN; Manufacturer Part Number: A-USBSB; ComponentHeight: 10.85mm; HelpURL: \\cern.ch\dfs\Applications\Altium\Datasheets\ASSMANN_A-USBSB.pdf; Author: CERN DEM JLC; CreateDate: 17.04.2018; LatestRevisionDate: 17.04.2018
Q2 = XTAL_40MHZ_EPSON_TSX-3225 40.0000MF10Z-B6: Crystal 4 pins 1=XTAL Control 2=GND3=XTAL 4=GND; Part Number: XTAL_12MHZ_EPSON_TSX-3225 12.0000MF10Z-B6; Part Description: Tolerance: ±10ppm,  Stability:±10ppm, -20°C to 75°C, 10pF, Surface Mount Quartz Crystal, TX-3225 Series; Manufacturer: EPSON; Manufacturer Part Number: TSX-3225 12.0000MF10Z-B6; PressFit: No; Bonding: No; Component Kind: Standard; Component Type: Standard; PackageDescription: Crystal, Corner Concave; 4 Pin, 2.50mm L X 3.20mm W X 0.6mm H, TSX-3225 Serie; Value: 12MHz; Pin Count: 4; Mounted: Yes; Socket: No; SMD: Yes; Sense: No; ComponentHeight: 0.6mm; HelpURL: \\cern.ch\dfs\Applications\Altium\Datasheets\XTAL_EPSON_TSX-3225.pdf; ComponentLink1URL: \\cern.ch\dfs\Applications\Altium\Datasheets\XTAL_EPSON_TSX-3225_Ordering-Informations.pdf; ComponentLink1Description: Ordering Informations; Author: CERN DEM HF; CreateDate: 24.10.2023; LatestRevisionDate: 24.10.2023
R4 R5 = R0805_470R_1%_0.125W_100PPM: Resistor - 5%; Part Number: R0805_470R_5%_0.125W_100PPM; Part Description: General Purpose Thick Film Chip Resistor; Manufacturer: GENERIC; Manufacturer1 Part Number: NRC10F4700TRF; Power: 0.125W; TC: ±100ppm/°C; PressFit: No; Component Kind: Standard; Component Type: Standard; Pin Count: 2; Value: 470; Status: Preferred; Manufacturer Part Number: R0805_470R_5%_0.125W_100PPM; Case: 0805; Mounted: Yes; Sense: No; Socket: No; SMD: Yes; Manufacturer1 Example: NIC COMPONENT; Manufacturer1 ComponentHeight: 0.6mm; HelpURL: \\cern.ch\dfs\Applications\Altium\Datasheets\R0805_NIC_NRC.pdf; Author: CERN DEM JLC; CreateDate: 3.12.2007; LatestRevisionDate: 13.03.2008
U2 = CH340G: USB to UART Converter SOP16; Manufacturer Part Number: CH340G

## Nets that join several sheets
+5: Relay_MCU (7 pins), Relay_Analog (C16.2 IC1.3 P2.3), Relay_USBtoUART (5 pins)
AGND: Relay_MCU (C4.1 C5.1 U1.21), Relay_Analog (C6.1 NT2.1)
GND: Relay_MCU (9 pins), Relay_Analog (16 pins), Relay_USBtoUART (9 pins)
VIN: Relay_MCU (R13.2), Relay_Analog (5 pins)
Input: Relay_MCU (U1.25), Relay_Analog (R3.1)
RESET: Relay_MCU (P.5 R1.1 U1.29), Relay_USBtoUART (C11.2)
RXD: Relay_MCU (U1.30), Relay_USBtoUART (R5.2)
TXD: Relay_MCU (U1.31), Relay_USBtoUART (R4.2)